# Altium schematic sheet [04] - Measure current.SchDoc
size A
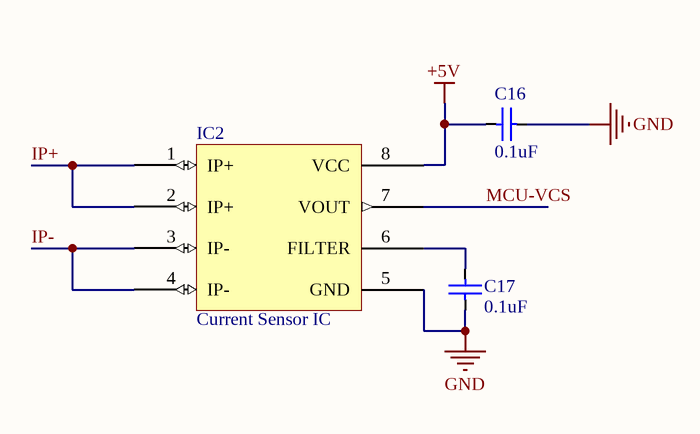
[diagram p0: [04] - Measure current.SchDoc]

## Parts
C16  0.1uF  [CAP_0805]
C17  0.1uF  [CAP_0805]
IC2  Current Sensor IC  [SOIC-8]

## Nets
+5V: C16.1 IC2.8(VCC)
GND: C16.2 C17.1 IC2.5(GND)
IP+: IC2.1(IP+) IC2.2(IP+)
IP-: IC2.3(IP-) IC2.4(IP-)
MCU-VCS: IC2.7(VOUT)
NetC17_2: C17.2 IC2.6(FILTER)

## Library data of the parts
C16 C17 = CapSMD: Capacitor; Value: 33p; Published: 8-Jun-2000; LatestRevisionDate: 17-Jul-2002; LatestRevisionNote: Re-released for DXP Platform.; PackageReference: RAD-0.3; Publisher: Altium Limited
IC2 = ACS712